# Altium schematic sheet [4] LED.SchDoc: LEDs
size A3; SheetNumber: 4; SheetTotal: 6
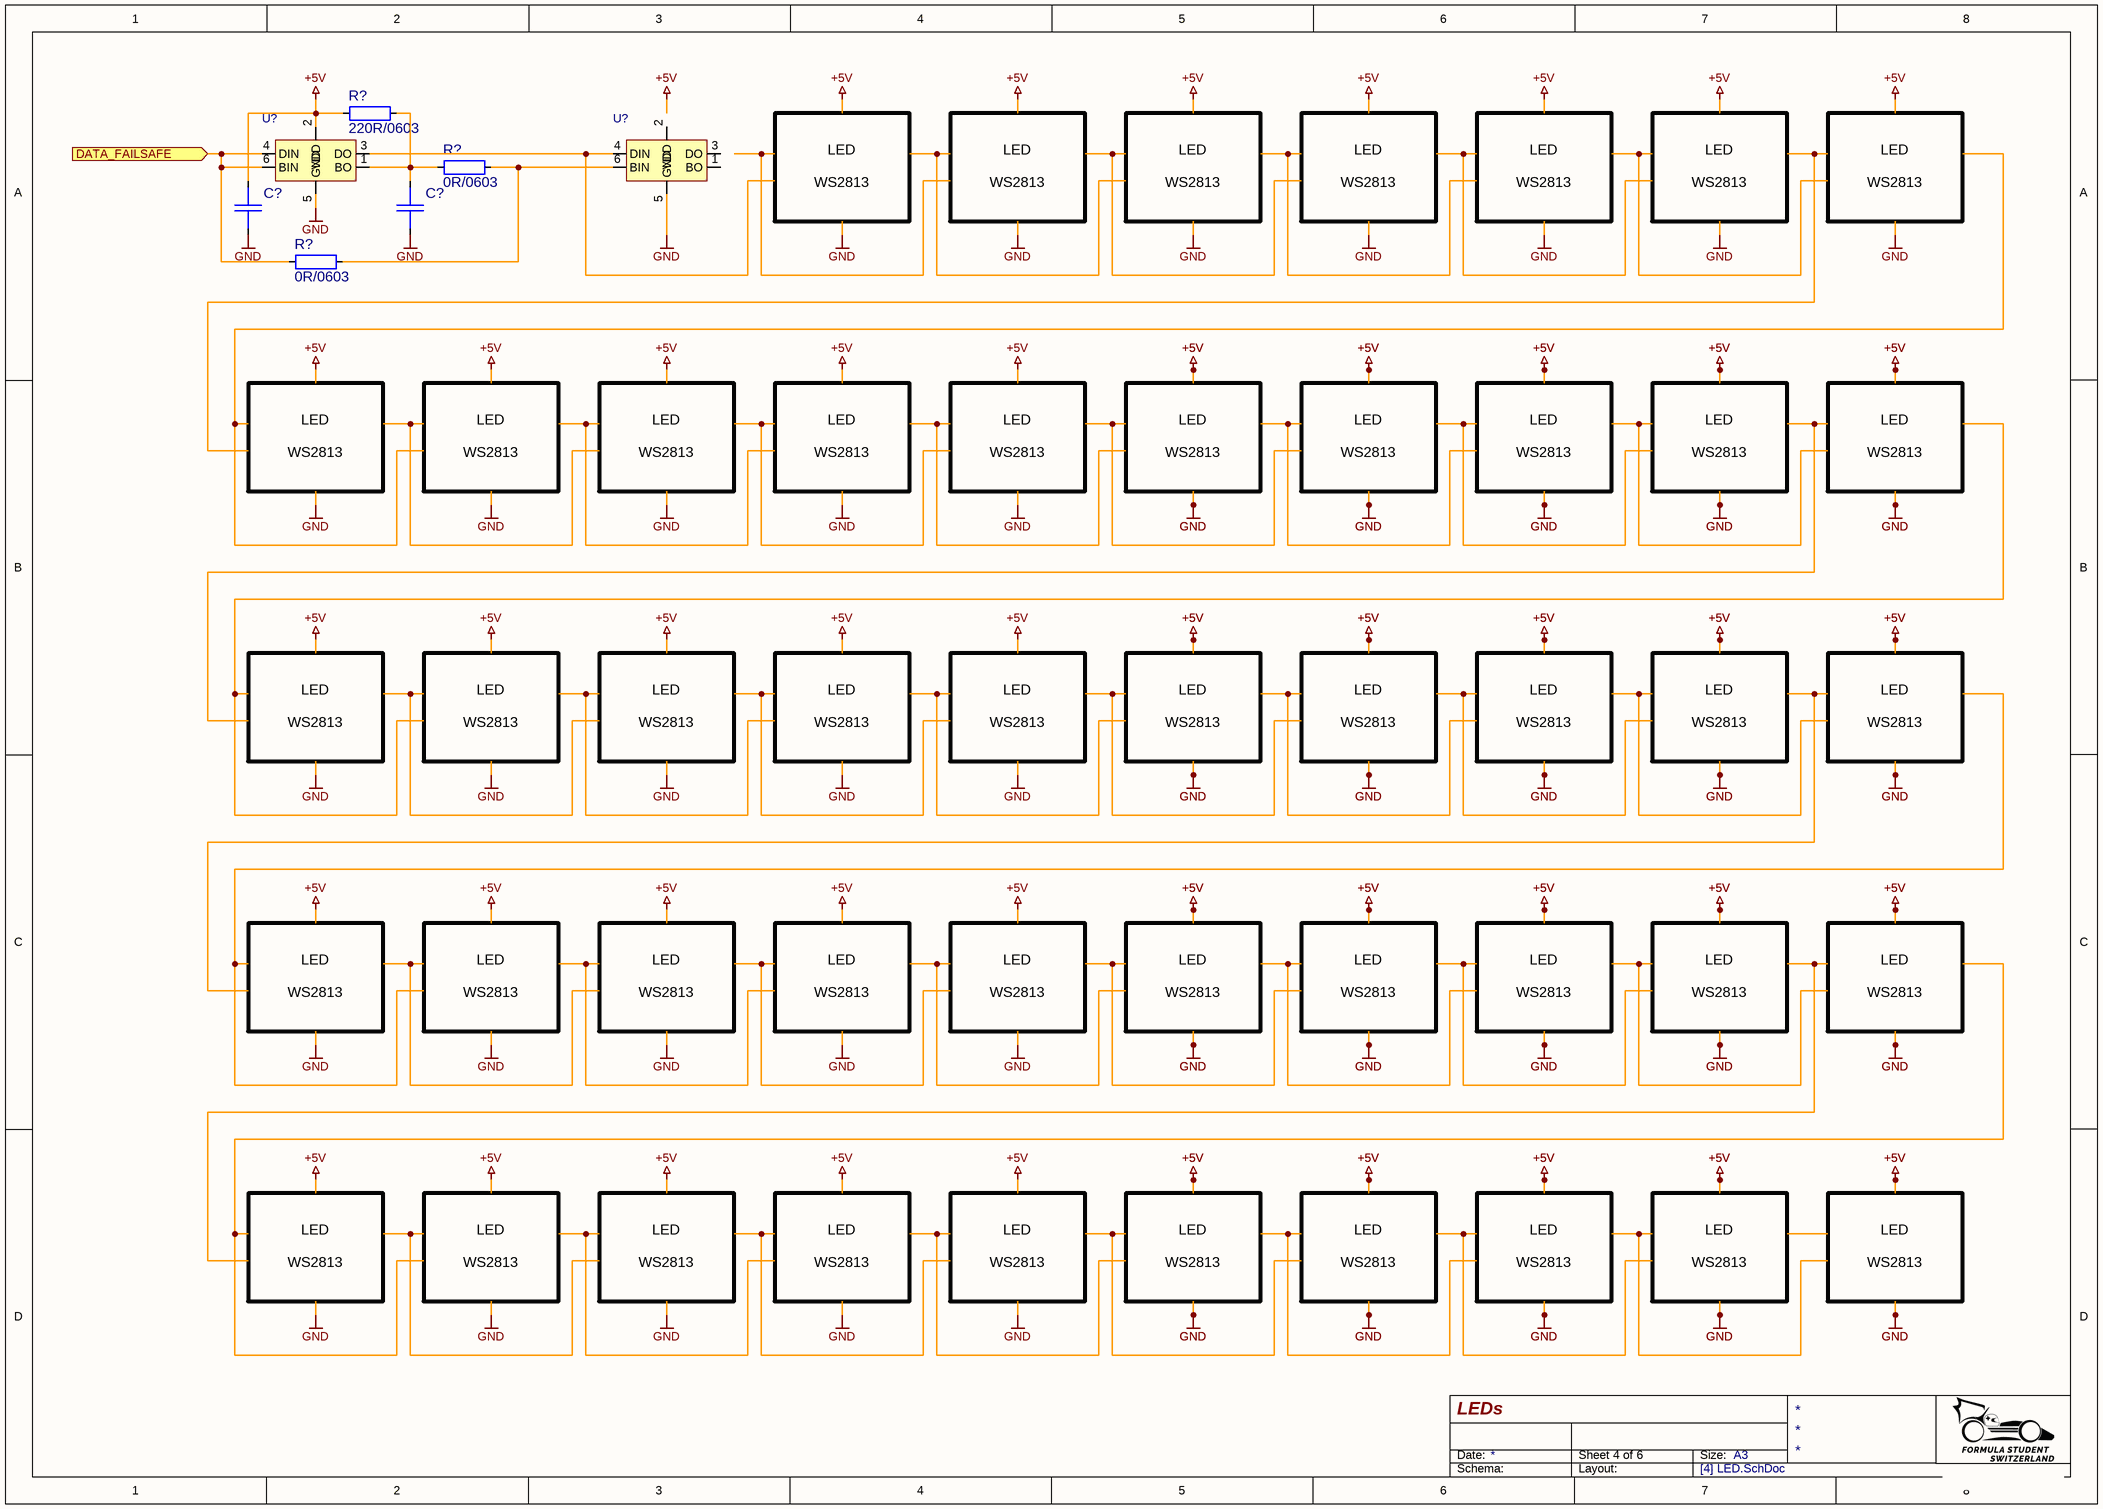
[diagram p0: [4] LED.SchDoc]

## Parts
(Parts that share a designator on the sheet are numbered #1, #2 ... from top to bottom, then left to right.)
C?#1  1.0U/0603/50V/X7R  [CAP0603_X7R]  (value not drawn)
C?#2  1.0U/0603/50V/X7R  [CAP0603_X7R]  (value not drawn)
R?#1  220R/0603  [R0603-0.40-WW]
R?#2  0R/0603  [R0603-0.40-WW]
R?#3  0R/0603  [R0603-0.40-WW]
U?#1  WS2813B-V5  [LEDM5050X165-6]  (value not drawn)
U?#2  WS2813B-V5  [LEDM5050X165-6]  (value not drawn)

## Ports
DATA_FAILSAFE (in)

## Nets
+5V: C?#1.1 R?#1.1 U?#1.2(VDD)
GND: C?#1.2 C?#2.2 U?#1.5(GND) U?#2.5(GND)
DATA_FAILSAFE: R?#3.1 U?#1.4(DIN) U?#1.6(BIN) ; port DATA_FAILSAFE
NetC?#2_1: C?#2.1 R?#1.2 R?#2.1 U?#1.1(BO)
NetR?#2_2: R?#2.2 R?#3.2 U?#2.6(BIN)
NetU?#1_3: U?#1.3(DO) U?#2.4(DIN)

Not connected (* = marked no-connect by the designer): U?#2 1(BO) 2(VDD) 3(DO)

## Notes on the sheet
- LED
  WS2813
- Date:
- Size:
- A3
- Schema:
- Layout:

## Library data of the parts
C?#1 C?#2 = 1.0U/0603/50V/X7R: CAP SM 0603 1.0uF 50V X7R; Manufacturer: GENERIC; Manufacturer 1: YAGEO; Manufacturer Part Number 1: CC0603KRX7R9BB105; Absolute Value: 1E-6; Part Number: 1.0U/0603/50V/X7R; Package: 603; Value: 1.0uF; HelpURL: https://www.yageo.com/upload/media/product/app/datasheet/mlcc/upy-gphc_x7r_6_3v-to-250v.pdf; Supplier 1: Digi-Key; Supplier Part Number 1: 311-2082-1-ND
R?#1 = 220R/0603: RES SM 0603 220R; Manufacturer: GENERIC; Manufacturer 1: YAGEO; Manufacturer Part Number 1: RC0603FR-13220RL; Absolute Value: 220; Part Number: 220R/0603; Package: 0603; Value: 220R; HelpURL: https://www.yageo.com/upload/media/product/app/datasheet/rchip/pyu-rc_group_51_rohs_l.pdf; Supplier 1: Digi-Key; Supplier Part Number 1: 13-RC0603FR-13220RLCT-ND; Manufacturer 2: YAGEO; Manufacturer Part Number 2: RC0603FR-10220RL; Supplier 2: Digi-Key; Supplier Part Number 2: 13-RC0603FR-10220RLCT-ND
R?#2 R?#3 = 0R/0603: RES SM 0603 0R; Manufacturer: GENERIC; Manufacturer 1: YAGEO; Manufacturer Part Number 1: RC0603FR-070RL; Absolute Value: 0; Part Number: 0R/0603; Package: 0603; Value: 0R; HelpURL: https://www.yageo.com/upload/media/product/app/datasheet/rchip/pyu-rc_group_51_rohs_l.pdf; Supplier 1: Digi-Key; Supplier Part Number 1: 311-0.0HRCT-ND; Manufacturer 2: YAGEO; Manufacturer Part Number 2: RC0603FR-130RL; Supplier 2: Digi-Key; Supplier Part Number 2: 13-RC0603FR-130RLCT-ND
U?#1 U?#2 = WS2813B-V5: Intelligent control LED integrated light source with backup Pin; Manufacturer: WorldSemi; Part Number: WS2813B-V5; Package: SMD5050; HelpURL: https://datasheet.lcsc.com/lcsc/2012110135_Worldsemi-WS2813B-V5_C965558.pdf; Manufacturer 1: WorldSemi; Manufacturer Part Number 1: WS2813B-V5; Supplier 1: LCSC.com; Supplier Part Number 1: C965558